# Altium schematic sheet MindPX V2.8 SCH.SchDoc
size A2; Date: 1111111111; PageSetup: Record=PageOptions|CenterHorizontal=True|CenterVertical=True|PrintScale=0.52|XCorrection=1.00|YCorrection=1.00|PrintKind=2|BorderSize=5000000|LeftOffset=0|BottomOffset=0|Orientation=2|PaperLength=1000|PaperWidth=1000|Scale=100|PaperSource=7|PrintQuality=600|MediaType=1|DitherType=10|PaperKind=A4|PrintScaleMode=1
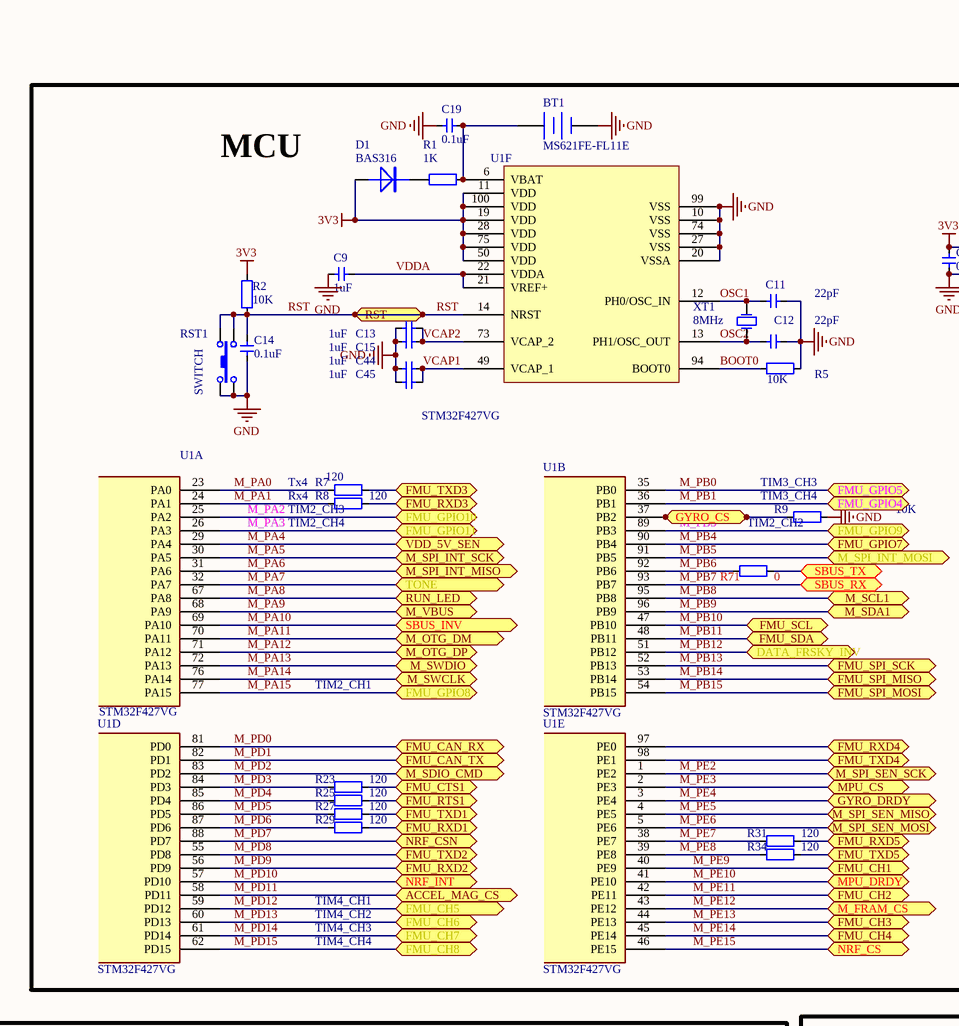
[diagram p0: MindPX V2.8 SCH.SchDoc, top left]
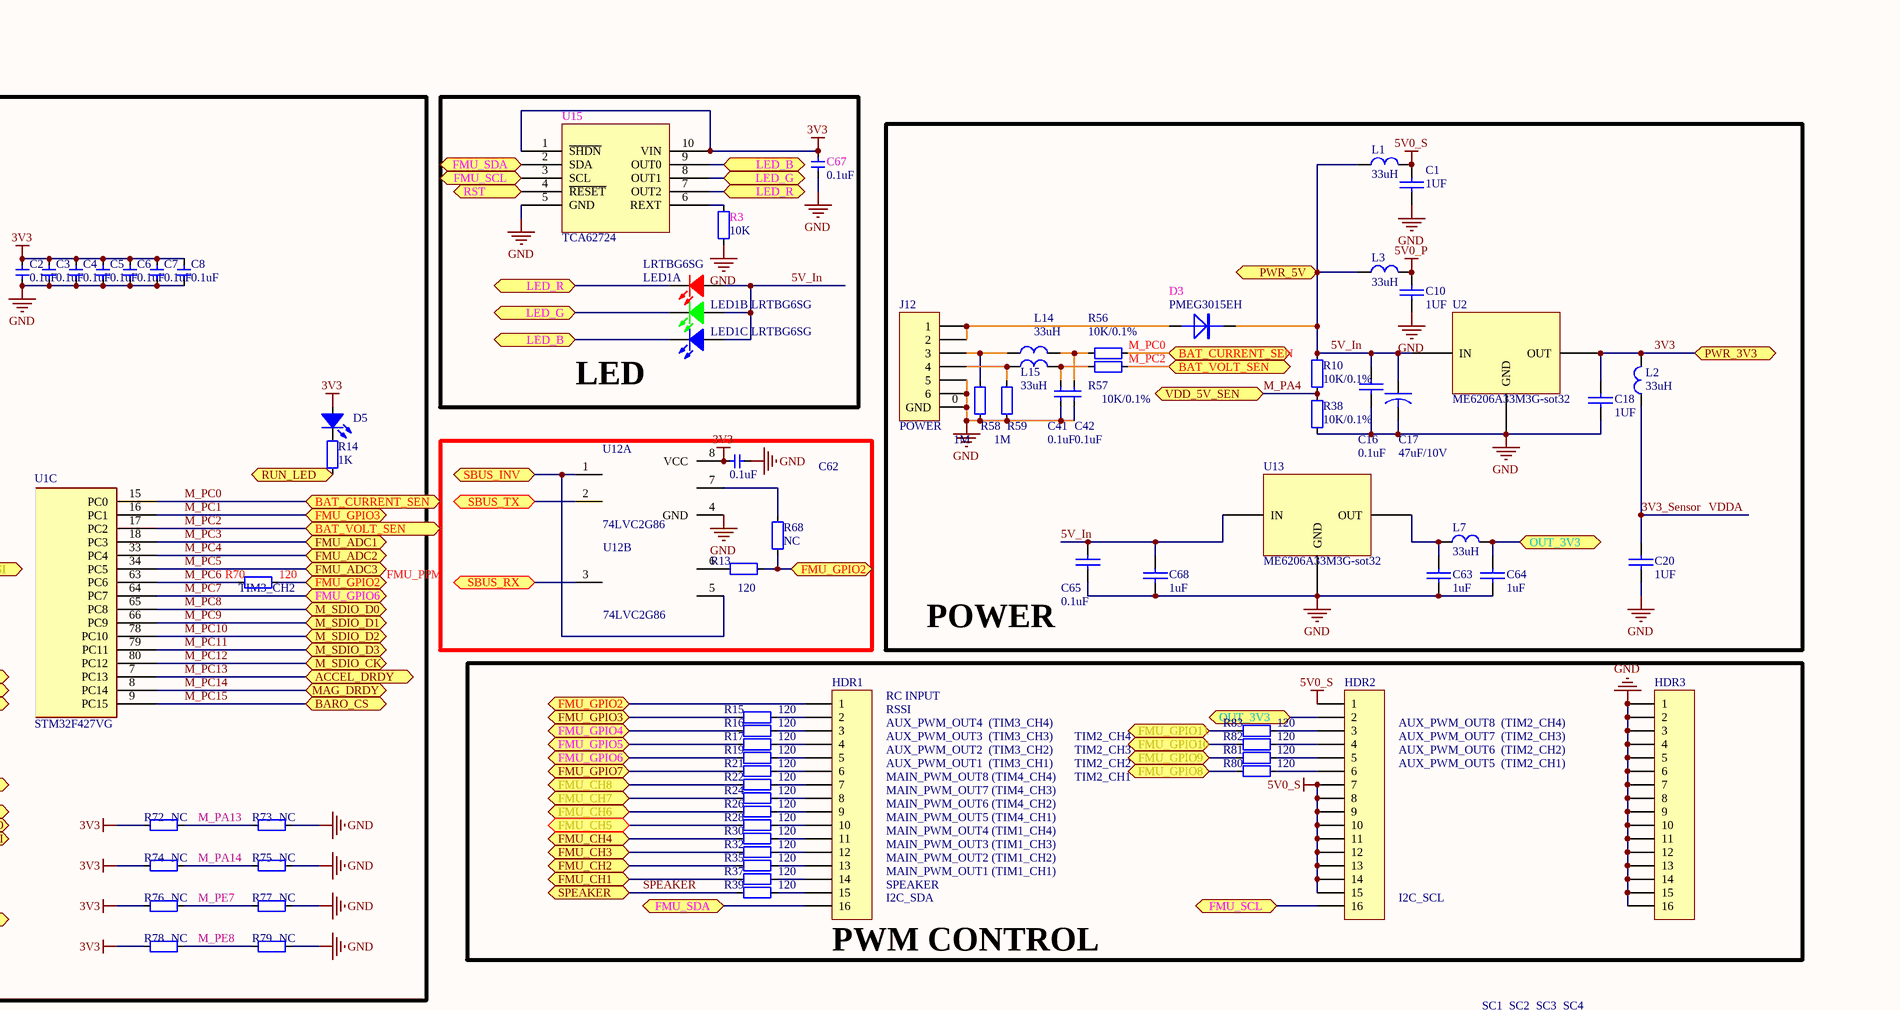
[diagram p1: MindPX V2.8 SCH.SchDoc, top right]
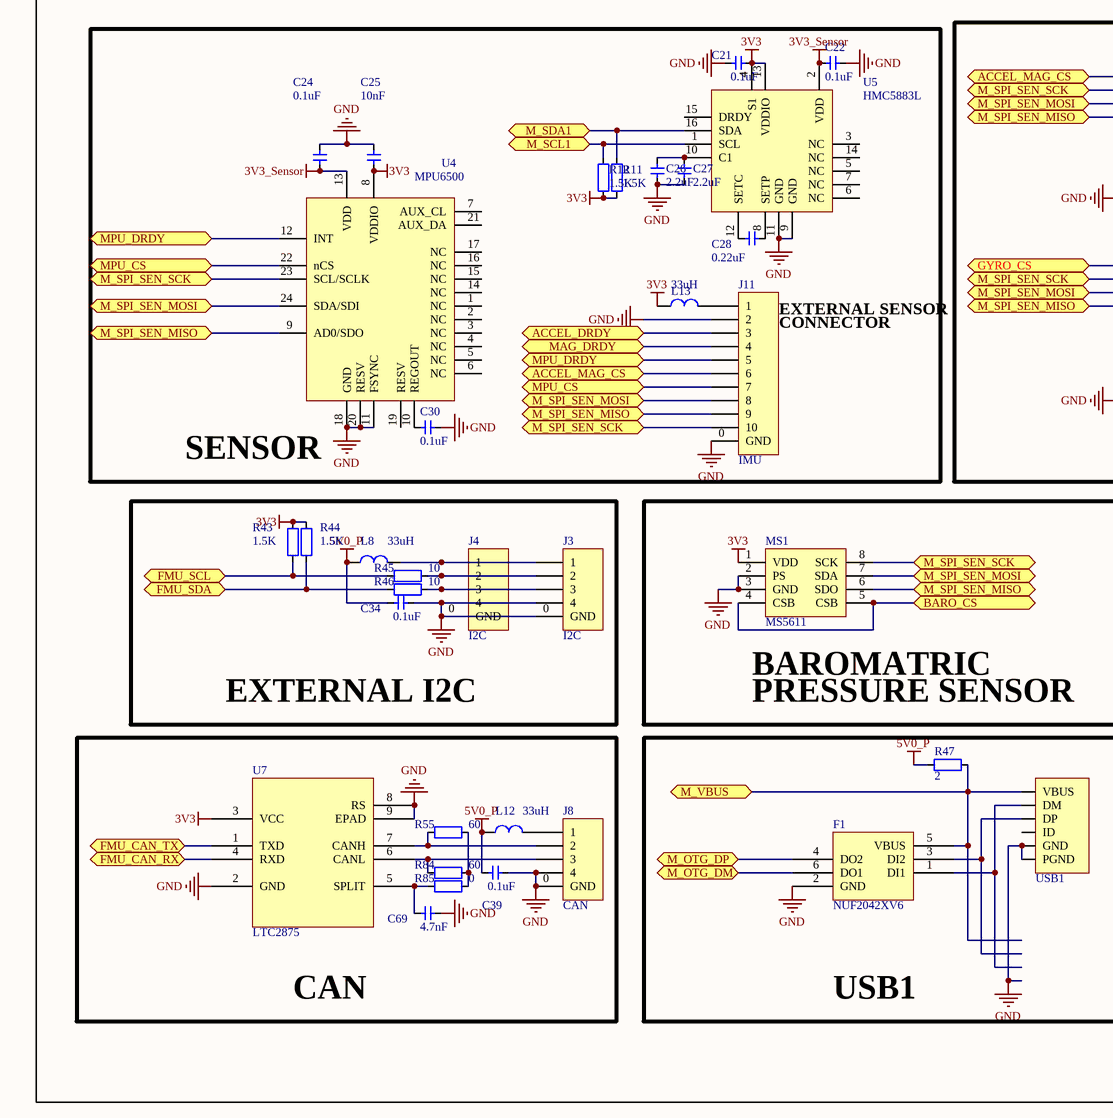
[diagram p2: MindPX V2.8 SCH.SchDoc, bottom left]
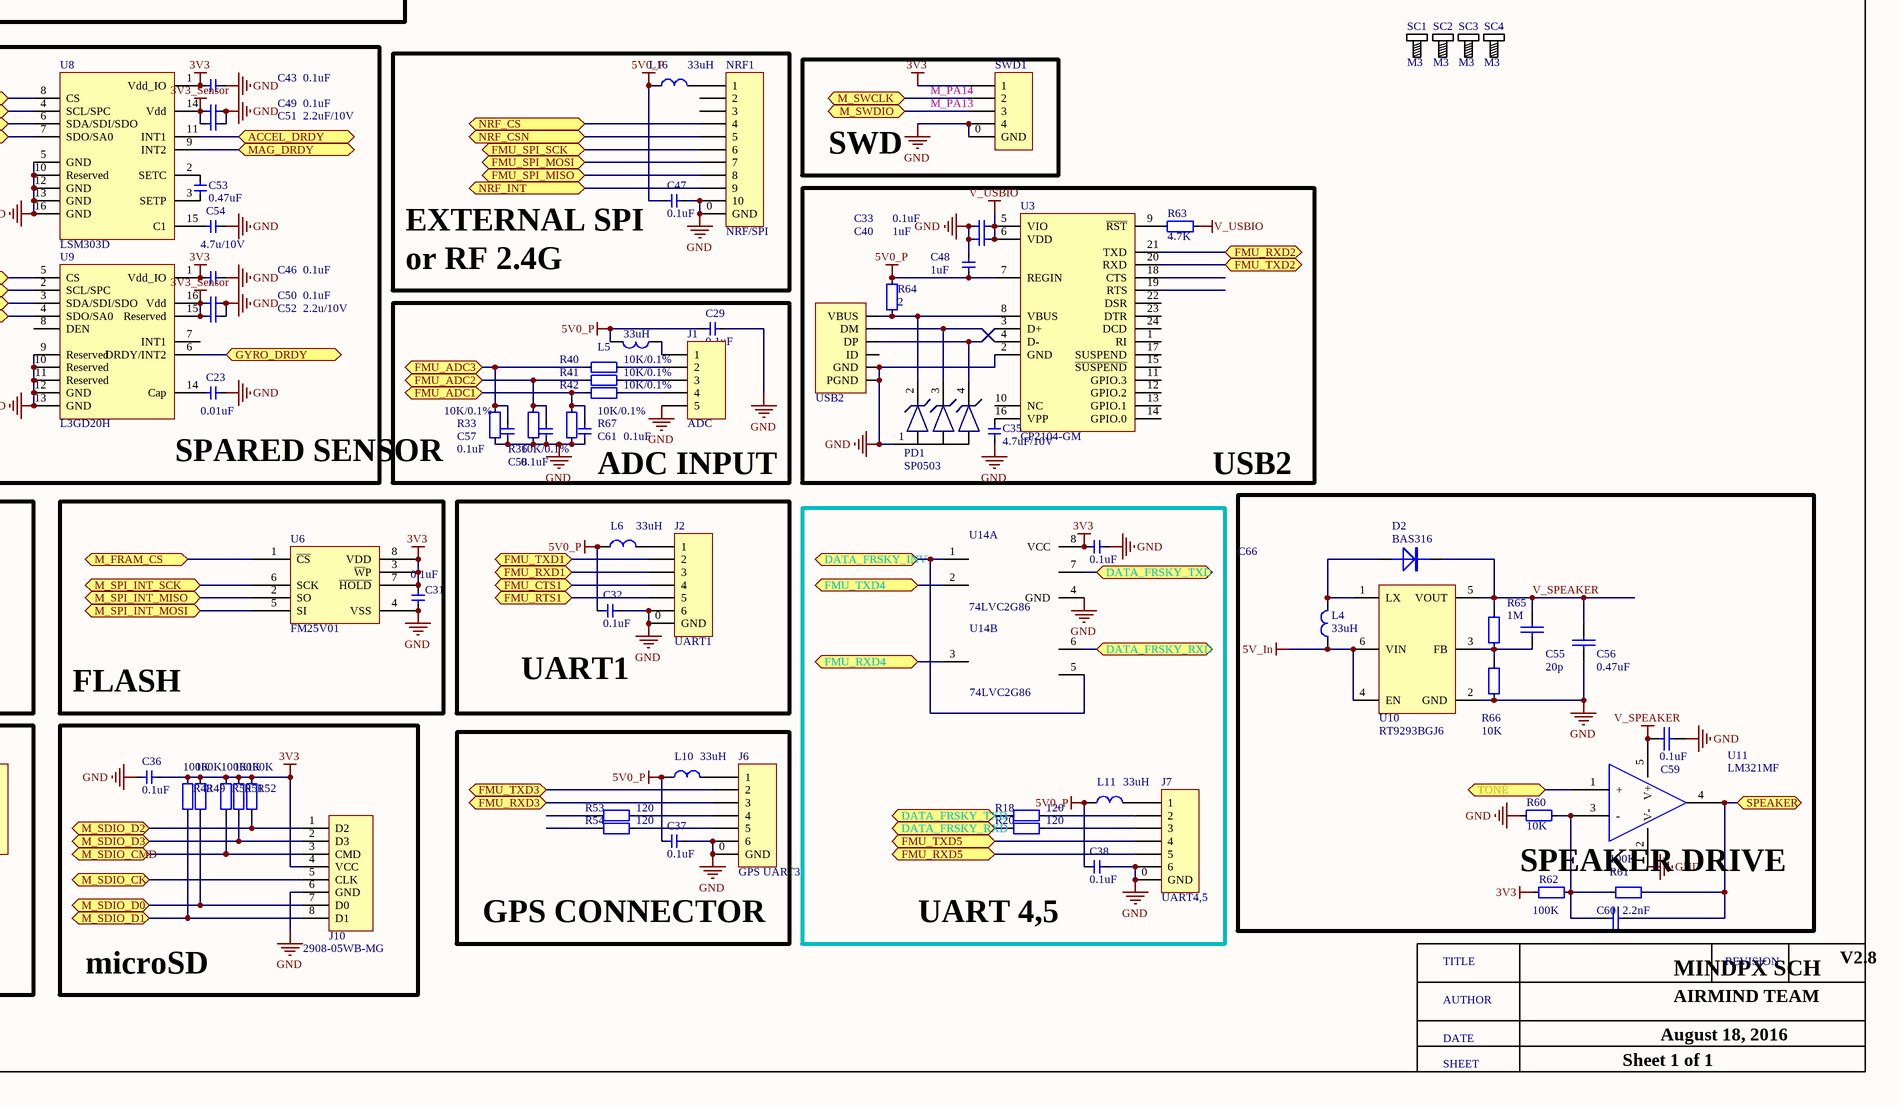
[diagram p3: MindPX V2.8 SCH.SchDoc, bottom right]

## Parts
BT1  MS621FE-FL11E  [MS621FE]
C1  1UF  [C0603]
C2  0.1uF  [C0603]
C3  0.1uF  [C0603]
C4  0.1uF  [C0603]
C5  0.1uF  [C0603]
C6  0.1uF  [C0603]
C7  0.1uF  [C0603]
C8  0.1uF  [C0603]
C9  1uF  [C0603]
C10  1UF  [C0603]
C11  22pF  [C0603]
C12  22pF  [C0603]
C13  1uF  [C0603]
C14  0.1uF  [C0603]
C15  1uF  [C0603]
C16  0.1uF  [C0603]
C17  47uF/10V  [钽电容]
C18  1UF  [C0603]
C19  0.1uF  [C0603]
C20  1UF  [C0603]
C21  0.1uF  [C0603]
C22  0.1uF  [C0603]
C23  0.01uF  [C0603]
C24  0.1uF  [C0603]
C25  10nF  [C0603]
C26  2.2uF  [C0603]
C27  2.2uF  [C0603]
C28  0.22uF  [C0603]
C29  0.1uF  [C0603]
C30  0.1uF  [C0603]
C31  0.1uF  [C0603]
C32  0.1uF  [C0603]
C33  0.1uF  [C0603]
C34  0.1uF  [C0603]
C35  4.7uF/10V  [C0603]
C36  0.1uF  [C0603]
C37  0.1uF  [C0603]
C38  0.1uF  [C0603]
C39  0.1uF  [C0603]
C40  1uF  [C0603]
C41  0.1uF  [C0603]
C42  0.1uF  [C0603]
C43  0.1uF  [C0603]
C44  1uF  [C0603]
C45  1uF  [C0603]
C46  0.1uF  [C0603]
C47  0.1uF  [C0603]
C48  1uF  [C0603]
C49  0.1uF  [C0603]
C50  0.1uF  [C0603]
C51  2.2uF/10V  [C0603]
C52  2.2u/10V  [C0603]
C53  0.47uF  [C0603]
C54  4.7u/10V  [C0603]
C55  20p  [C0603]
C56  0.47uF  [C0805]
C57  0.1uF  [C0603]
C58  0.1uF  [C0603]
C59  0.1uF  [C0603]
C60  2.2nF  [C0603]
C61  0.1uF  [C0603]
C62  0.1uF  [C0603]
C63  1uF  [C0603]
C64  1uF  [C0603]
C65  0.1uF  [C0603]
C66  0.1uF  [C0603]
C67  0.1uF  [C0603]
C68  1uF  [C0603]
C69  4.7nF  [C0603]
D1  BAS316  [SOD323_AK]
D2  BAS316  [SOD323_AK]
D3  PMEG3015EH  [SOD123/X.85]
D5  LED_0603  [0603]  (value not drawn)
F1  NUF2042XV6  [SOT-563-6]
HDR1  MHDR1X16  [HDR1X16]  (value not drawn)
HDR2  MHDR1X16  [HDR1X16]  (value not drawn)
HDR3  MHDR1X16  [HDR1X16]  (value not drawn)
J1  ADC  [HDR1X5]
J2  UART1  [DF13A-6P-1.25H]
J3  I2C  [DF13A-4P-1.25H]
J4  I2C  [DF13A-4P-1.25H]
J6  GPS UART3  [DF13A-6P-1.25H]
J7  UART4,5  [DF13A-6P-1.25H]
J8  CAN  [DF13A-4P-1.25H]
J10  2908-05WB-MG  [SD_Card_TF]
J11  IMU  [FPC10/0.5]
J12  POWER  [DF13A-6P-1.25H]
L1  33uH  [L0603]
L2  33uH  [L0603]
L3  33uH  [L0603]
L4  33uH  [L0805]
L5  33uH  [L0603]
L6  33uH  [L0603]
L7  33uH  [L0603]
L8  33uH  [L0603]
L10  33uH  [L0603]
L11  33uH  [L0603]
L12  33uH  [L0603]
L13  33uH  [L0603]
L14  33uH  [L0603]
L15  33uH  [L0603]
L16  33uH  [L0603]
LED1  LRTBG6SG  [LRTBG6SG]  (parts A,B,C of 3)
MS1  MS5611  [MS5611]
NRF1  NRF/SPI  [DF13A-10P-1.25H]
PD1  SP0503
R1  1K  [R0603]
R2  10K  [R0603]
R3  10K  [R0603]
R5  10K  [R0603]
R7  120  [R0603]
R8  120  [R0603]
R9  10K  [R0603]
R10  10K/0.1%  [R0603]
R11  1.5K  [R0603]
R12  1.5K  [R0603]
R13  120  [R0603]
R14  1K  [R0603]
R15  120  [R0603]
R16  120  [R0603]
R17  120  [R0603]
R18  120  [R0603]
R19  120  [R0603]
R20  120  [R0603]
R21  120  [R0603]
R22  120  [R0603]
R23  120  [R0603]
R24  120  [R0603]
R25  120  [R0603]
R26  120  [R0603]
R27  120  [R0603]
R28  120  [R0603]
R29  120  [R0603]
R30  120  [R0603]
R31  120  [R0603]
R32  120  [R0603]
R33  10K/0.1%  [R0603]
R34  120  [R0603]
R35  120  [R0603]
R36  10K/0.1%  [R0603]
R37  120  [R0603]
R38  10K/0.1%  [R0603]
R39  120  [R0603]
R40  10K/0.1%  [R0603]
R41  10K/0.1%  [R0603]
R42  10K/0.1%  [R0603]
R43  1.5K  [R0603]
R44  1.5K  [R0603]
R45  10  [R0603]
R46  10  [R0603]
R47  2  [R0603]
R48  100K  [R0603]
R49  100K  [R0603]
R50  100K  [R0603]
R51  100K  [R0603]
R52  100K  [R0603]
R53  120  [R0603]
R54  120  [R0603]
R55  60  [R0603]
R56  10K/0.1%  [R0603]
R57  10K/0.1%  [R0603]
R58  1M  [R0603]
R59  1M  [R0603]
R60  10K  [R0603]
R61  100K  [R0603]
R62  100K  [R0603]
R63  4.7K  [R0603]
R64  2  [R0603]
R65  1M  [R0603]
R66  10K  [R0603]
R67  10K/0.1%  [R0603]
R68  NC  [R0603]
R70  120  [R0603]
R71  0  [R0603]
R72  NC  [R0603]
R73  NC  [R0603]
R74  NC  [R0603]
R75  NC  [R0603]
R76  NC  [R0603]
R77  NC  [R0603]
R78  NC  [R0603]
R79  NC  [R0603]
R80  120  [R0603]
R81  120  [R0603]
R82  120  [R0603]
R83  120  [R0603]
R84  60  [R0603]
R85  0  [R0603]
RST1  SWITCH  [BT_TACT_3.5*3.55_90]
SC1  M3  [SCRREW_M3]
SC2  M3  [SCRREW_M3]
SC3  M3  [SCRREW_M3]
SC4  M3  [SCRREW_M3]
SWD1  DEBUG  [DF13A-4P-1.25H]  (value not drawn)
U1  STM32F427VG  (parts A,B,C,D,E,F of 6)
U2  ME6206A33M3G-sot32  [me6206a33mg-sot23]
U3  CP2104-GM  [QFN24]
U4  MPU6500  [MPU6500]
U5  HMC5883L  [LPcc16]
U6  FM25V01  [so8]
U7  LTC2875  [DFN-8_DD]
U8  LSM303D  [LSM303D]
U9  L3GD20H  [L3GD20H]
U10  RT9293BGJ6  [TSOT23-6]
U11  LM321MF  [SOT23-5]
U12  74LVC2G86  [VSSOP8]  (parts A,B of 2)
U13  ME6206A33M3G-sot32  [me6206a33mg-sot23]
U14  74LVC2G86  [VSSOP8]  (parts A,B of 2)
U15  TCA62724  [SON10]
USB1  USB_QG  [MicroUSB_T2]  (value not drawn)
USB2  USB_Micro  [MicroUSB_T2]  (value not drawn)
XT1  value 8MHz  [XTAL_5032]  (hidden comment: XTAL_5032_2P)

## Blocks framed on the sheet
MCU: BT1 C2-C9 C11-C15 C19 C44 C45 D1 D5 R1 R2 R5 R7-R9 R14 R23 R25 R27 R29 R31 R34 R70-R79 RST1 U1 XT1
LED: C67 LED1 R3 U15
POWER: C1 C10 C16-C18 C20 C41 C42 C63-C65 C68 D3 J12 L1-L3 L7 L14 L15 R10 R38 R56-R59 U2 U13
PWM CONTROL: HDR1-HDR3 R15-R17 R19 R21 R22 R24 R26 R28 R30 R32 R35 R37 R39 R80-R83
SENSOR: C21 C22 C24-C28 C30 J11 L13 R11 R12 U4 U5
SPARED SENSOR: C23 C43 C46 C49-C54 U8 U9
SWD: SWD1
USB2: C33 C35 C40 C48 PD1 R63 R64 U3 USB2
ADC INPUT: C29 C57 C58 C61 J1 L5 R33 R36 R40-R42 R67
EXTERNAL I2C: C34 J3 J4 L8 R43-R46
FLASH: C31 U6
UART1: C32 J2 L6
UART 4,5: C38 C66 J7 L11 R18 R20 U14
SPEAKER DRIVE: C55 C56 C59 C60 D2 L4 R60-R62 R65 R66 U10 U11
CAN: C39 C69 J8 L12 R55 R84 R85 U7
USB1: F1 R47 USB1
GPS CONNECTOR: C37 J6 L10 R53 R54

## Ports
ACCEL_DRDY, ACCEL_MAG_CS, BARO_CS, BAT_CURRENT_SEN, BAT_VOLT_SEN, DATA_FRSKY_INV, DATA_FRSKY_RXD, DATA_FRSKY_TXD, FMU_ADC1, FMU_ADC2, FMU_ADC3, FMU_CAN_RX, FMU_CAN_TX, FMU_CH1, FMU_CH2, FMU_CH3, FMU_CH4, FMU_CH5, FMU_CH6, FMU_CH7, FMU_CH8, FMU_CTS1, FMU_GPIO2, FMU_GPIO3, FMU_GPIO4, FMU_GPIO5, FMU_GPIO6, FMU_GPIO7, FMU_GPIO8, FMU_GPIO9, FMU_GPIO10, FMU_GPIO11, FMU_RTS1, FMU_RXD1, FMU_RXD2, FMU_RXD3, FMU_RXD4, FMU_RXD5, FMU_SCL, FMU_SDA, FMU_SPI_MISO, FMU_SPI_MOSI, FMU_SPI_SCK, FMU_TXD1, FMU_TXD2, FMU_TXD3, FMU_TXD4, FMU_TXD5, GYRO_CS, GYRO_DRDY, LED_B, LED_G, LED_R, M_FRAM_CS, M_OTG_DM, M_OTG_DP, M_SCL1, M_SDA1, M_SDIO_CK, M_SDIO_CMD, M_SDIO_D0, M_SDIO_D1, M_SDIO_D2, M_SDIO_D3, M_SPI_INT_MISO, M_SPI_INT_MOSI, M_SPI_INT_SCK, M_SPI_SEN_MISO, M_SPI_SEN_MOSI, M_SPI_SEN_SCK, M_SWCLK, M_SWDIO, M_VBUS, MAG_DRDY, MPU_CS, MPU_DRDY, NRF_CS, NRF_CSN, NRF_INT, OUT_3V3, PWR_3V3, PWR_5V, RST, RUN_LED, SBUS_INV, SBUS_RX, SBUS_TX, SPEAKER, TONE, VDD_5V_SEN

## Nets
3V3: C2.1 C3.1 C4.1 C5.1 C6.1 C7.1 C8.1 C18.1 C21.2 C25.1 C31.1 C36.1 C43.2 C46.2 C62.1 C66.1 C67.2 D1.A D5.2(A) J10.4(VCC) L2.2 L13.1 MS1.1(VDD) R2.2 R11.2 R12.1 R43.1 R44.1 R48.1 R49.1 R50.1 R51.1 R52.1 R62.2 R72.2 R74.2 R76.2 R78.2 SWD1.1 U1.11(VDD) U1.19(VDD) U1.28(VDD) U1.50(VDD) U1.75(VDD) U1.100(VDD) U2.2(OUT) U4.8(VDDIO) U5.4(S1) U5.13(VDDIO) U6.3(~{W}P) U6.7(~{HOLD}) U6.8(VDD) U7.3(VCC) U8.1(Vdd_IO) U9.1(Vdd_IO) U12.8(VCC) U14.8(VCC) U15.1(~{SHDN}) U15.10(VIN) ; port PWR_3V3
3V3_Sensor: C9.1 C20.1 C22.1 C24.2 C49.2 C50.2 C51.2 C52.2 L2.1 U1.21(VREF+) U1.22(VDDA) U4.13(VDD) U5.2(VDD) U8.14(Vdd) U9.15(Reserved) U9.16(Vdd)  [also labelled VDDA]
5V0_P: C10.1 C29.1 C32.1 C34.1 C37.1 C38.1 C39.1 C47.1 C48.2 L3.2 L5.2 L6.1 L8.1 L10.1 L11.1 L12.1 L16.1 R47.1 R64.1 U3.7(REGIN)
5V0_S: C1.1 HDR2.1 HDR2.7 HDR2.8 HDR2.9 HDR2.10 HDR2.11 HDR2.12 HDR2.13 HDR2.14 HDR2.15 L1.2
5V_In: C16.1 C17.1 C65.1 C68.1 D3.K L1.1 L3.1 L4.1 LED1.A1 LED1.A2 LED1.A3 R10.1 U2.3(IN) U10.4(EN) U10.6(VIN) U13.3(IN) ; port PWR_5V
GND: BT1.2(-) C1.2 C2.2 C3.2 C4.2 C5.2 C6.2 C7.2 C8.2 C9.2 C10.2 C11.1 C12.1 C13.1 C14.2 C15.2 C16.2 C17.2 C18.2 C19.2 C20.2 C21.1 C22.2 C23.1 C24.1 C25.2 C26.1 C27.1 C29.2 C30.1 C31.2 C32.2 C33.1 C34.2 C35.1 C36.2 C37.2 C38.2 C39.2 C40.1 C41.2 C42.2 C43.1 C44.2 C45.2 C46.1 C47.2 C48.1 C49.1 C50.1 C51.1 C52.1 C54.1 C56.2 C57.1 C58.1 C59.2 C61.1 C62.2 C63.2 C64.2 C65.2 C66.2 C67.1 C68.2 C69.2 F1.2(GND) HDR3.1 HDR3.2 HDR3.3 HDR3.4 HDR3.5 HDR3.6 HDR3.7 HDR3.8 HDR3.9 HDR3.10 HDR3.11 HDR3.12 HDR3.13 HDR3.14 HDR3.15 HDR3.16 J1.5 J2.0(GND) J2.6 J3.0(GND) J3.4 J4.0(GND) J4.4 J6.0(GND) J6.6 J7.0(GND) J7.6 J8.0(GND) J8.4 J10.6(GND) J11.0(GND) J11.2 J12.0(GND) J12.5 J12.6 MS1.2(PS) MS1.3(GND) NRF1.0(GND) NRF1.10 PD1.1 R3.2 R5.1 R9.1 R33.2 R36.2 R38.2 R58.2 R59.2 R60.1 R66.2 R67.2 R73.1 R75.1 R77.1 R79.1 RST1.1 RST1.3 SWD1.0(GND) SWD1.4 U1.10(VSS) U1.20(VSSA) U1.27(VSS) U1.74(VSS) U1.99(VSS) U2.1(GND) U3.2(GND) U4.11(FSYNC) U4.18(GND) U4.20(RESV) U5.9(GND) U5.11(GND) U6.4(VSS) U7.2(GND) U7.8(RS) U7.9(EPAD) U8.5(GND) U8.10(Reserved) U8.12(GND) U8.13(GND) U8.16(GND) U9.9(Reserved) U9.10(Reserved) U9.11(Reserved) U9.12(GND) U9.13(GND) U10.2(GND) U11.2(V-) U12.4(GND) U13.1(GND) U14.4(GND) U15.5(GND) USB1.0(PGND) USB1.5(GND) USB2.0(PGND) USB2.5(GND)
V_SPEAKER: C55.1 C56.1 C59.1 D2.K R65.1 U10.5(VOUT) U11.5(V+)
V_USBIO: C33.2 C40.2 R63.2 U3.5(VIO) U3.6(VDD)
BOOT0: R5.2 U1.94(BOOT0)
DATA_FRSKY_RXD: R20.2 U14.6(2B) ; port DATA_FRSKY_RXD
DATA_FRSKY_TXD: R18.2 U14.7(1Y) ; port DATA_FRSKY_TXD
FMU_CTS1: J2.4 R23.1 ; port FMU_CTS1
FMU_GPIO2: HDR1.1 R13.1 R68.2 R70.1 ; port FMU_GPIO2
FMU_RTS1: J2.5 R25.1 ; port FMU_RTS1
FMU_RXD1: J2.3 R29.1 ; port FMU_RXD1
FMU_RXD3: J6.3 R8.1 ; port FMU_RXD3
FMU_RXD4: U1.97(PE0) U14.3(2Y) ; port FMU_RXD4
FMU_RXD5: J7.5 R31.1 ; port FMU_RXD5
FMU_TXD1: J2.2 R27.1 ; port FMU_TXD1
FMU_TXD3: J6.2 R7.1 ; port FMU_TXD3
FMU_TXD4: U1.98(PE1) U14.2(1B) ; port FMU_TXD4
FMU_TXD5: J7.4 R34.1 ; port FMU_TXD5
GYRO_CS: R9.2 U1.37(PB2) U9.5(CS) ; port GYRO_CS
LED_B: LED1.C3 U15.9(OUT0) ; port LED_B
LED_G: LED1.C2 U15.8(OUT1) ; port LED_G
LED_R: LED1.C1 U15.7(OUT2) ; port LED_R
M_PA0: R7.2 U1.23(PA0)
M_PA1: R8.2 U1.24(PA1)
M_PA2: R82.2 U1.25(PA2) ; port FMU_GPIO10
M_PA3: R83.2 U1.26(PA3) ; port FMU_GPIO11
M_PA4: R10.2 R38.1 U1.29(PA4) ; port VDD_5V_SEN
M_PA5: U1.30(PA5) U6.6(SCK) ; port M_SPI_INT_SCK
M_PA6: U1.31(PA6) U6.2(SO) ; port M_SPI_INT_MISO
M_PA7: U1.32(PA7) U11.1(+) ; port TONE
M_PA8: R14.1 U1.67(PA8) ; port RUN_LED
M_PA9: F1.5(VBUS) R47.2 U1.68(PA9) USB1.1(VBUS) ; port M_VBUS
M_PA10: U1.69(PA10) U12.1(1A) U12.5(2A) ; port SBUS_INV
M_PA11: F1.6(DO1) U1.70(PA11) ; port M_OTG_DM
M_PA12: F1.4(DO2) U1.71(PA12) ; port M_OTG_DP
M_PA13: R72.1 R73.2 SWD1.3 U1.72(PA13) ; port M_SWDIO
M_PA14: R74.1 R75.2 SWD1.2 U1.76(PA14) ; port M_SWCLK
M_PA15: R80.2 U1.77(PA15) ; port FMU_GPIO8
M_PB0: R17.2 U1.35(PB0) ; port FMU_GPIO5
M_PB1: R16.2 U1.36(PB1) ; port FMU_GPIO4
M_PB3: R81.2 U1.89(PB3) ; port FMU_GPIO9
M_PB4: R21.2 U1.90(PB4) ; port FMU_GPIO7
M_PB5: U1.91(PB5) U6.5(SI) ; port M_SPI_INT_MOSI
M_PB6: R71.2 U1.92(PB6)
M_PB7: U1.93(PB7) U12.3(2Y) ; port SBUS_RX
M_PB8: R12.2 U1.95(PB8) U5.1(SCL) ; port M_SCL1
M_PB9: R11.1 U1.96(PB9) U5.16(SDA) ; port M_SDA1
M_PB10: HDR2.16 R43.2 R45.2 U1.47(PB10) U15.3(SCL) ; port FMU_SCL
M_PB11: HDR1.16 R44.2 R46.2 U1.48(PB11) U15.2(SDA) ; port FMU_SDA
M_PB12: U1.51(PB12) U14.1(1A) U14.5(2A) ; port DATA_FRSKY_INV
M_PB13: NRF1.6 U1.52(PB13) ; port FMU_SPI_SCK
M_PB14: NRF1.8 U1.53(PB14) ; port FMU_SPI_MISO
M_PB15: NRF1.7 U1.54(PB15) ; port FMU_SPI_MOSI
M_PC0: R56.1 U1.15(PC0) ; port BAT_CURRENT_SEN
M_PC1: R15.2 U1.16(PC1) ; port FMU_GPIO3
M_PC2: R57.1 U1.17(PC2) ; port BAT_VOLT_SEN
M_PC3: C61.2 R42.2 R67.1 U1.18(PC3) ; port FMU_ADC1
M_PC4: C58.2 R36.1 R41.2 U1.33(PC4) ; port FMU_ADC2
M_PC5: C57.2 R33.1 R40.2 U1.34(PC5) ; port FMU_ADC3
M_PC6: R70.2 U1.63(PC6)
M_PC7: R19.2 U1.64(PC7) ; port FMU_GPIO6
M_PC8: J10.7(D0) R49.2 U1.65(PC8) ; port M_SDIO_D0
M_PC9: J10.8(D1) R48.2 U1.66(PC9) ; port M_SDIO_D1
M_PC10: J10.1(D2) R52.2 U1.78(PC10) ; port M_SDIO_D2
M_PC11: J10.2(D3) R51.2 U1.79(PC11) ; port M_SDIO_D3
M_PC12: J10.5(CLK) U1.80(PC12) ; port M_SDIO_CK
M_PC13: J11.3 U1.7(PC13) U8.11(INT1) ; port ACCEL_DRDY
M_PC14: J11.4 U1.8(PC14) U8.9(INT2) ; port MAG_DRDY
M_PC15: MS1.4(CSB) MS1.5(CSB) U1.9(PC15) ; port BARO_CS
M_PD0: U1.81(PD0) U7.4(RXD) ; port FMU_CAN_RX
M_PD1: U1.82(PD1) U7.1(TXD) ; port FMU_CAN_TX
M_PD2: J10.3(CMD) R50.2 U1.83(PD2) ; port M_SDIO_CMD
M_PD3: R23.2 U1.84(PD3)
M_PD4: R25.2 U1.85(PD4)
M_PD5: R27.2 U1.86(PD5)
M_PD6: R29.2 U1.87(PD6)
M_PD7: NRF1.5 U1.88(PD7) ; port NRF_CSN
M_PD8: U1.55(PD8) U3.20(RXD) ; port FMU_TXD2
M_PD9: U1.56(PD9) U3.21(TXD) ; port FMU_RXD2
M_PD10: NRF1.9 U1.57(PD10) ; port NRF_INT
M_PD11: J11.6 U1.58(PD11) U8.8(CS) ; port ACCEL_MAG_CS
M_PD12: R28.2 U1.59(PD12) ; port FMU_CH5
M_PD13: R26.2 U1.60(PD13) ; port FMU_CH6
M_PD14: R24.2 U1.61(PD14) ; port FMU_CH7
M_PD15: R22.2 U1.62(PD15) ; port FMU_CH8
M_PE2: J11.10 MS1.8(SCK) U1.1(PE2) U4.23(SCL/SCLK) U8.4(SCL/SPC) U9.2(SCL/SPC) ; port M_SPI_SEN_SCK
M_PE3: J11.7 U1.2(PE3) U4.22(nCS) ; port MPU_CS
M_PE4: U1.3(PE4) U9.6(DRDY/INT2) ; port GYRO_DRDY
M_PE5: J11.9 MS1.6(SDO) U1.4(PE5) U4.9(AD0/SDO) U8.7(SDO/SA0) U9.4(SDO/SA0) ; port M_SPI_SEN_MISO
M_PE6: J11.8 MS1.7(SDA) U1.5(PE6) U4.24(SDA/SDI) U8.6(SDA/SDI/SDO) U9.3(SDA/SDI/SDO) ; port M_SPI_SEN_MOSI
M_PE7: R31.2 R76.1 R77.2 U1.38(PE7)
M_PE8: R34.2 R78.1 R79.2 U1.39(PE8)
M_PE9: R37.2 U1.40(PE9) ; port FMU_CH1
M_PE10: J11.5 U1.41(PE10) U4.12(INT) ; port MPU_DRDY
M_PE11: R35.2 U1.42(PE11) ; port FMU_CH2
M_PE12: U1.43(PE12) U6.1(~{CS}) ; port M_FRAM_CS
M_PE13: R32.2 U1.44(PE13) ; port FMU_CH3
M_PE14: R30.2 U1.45(PE14) ; port FMU_CH4
M_PE15: NRF1.4 U1.46(PE15) ; port NRF_CS
OSC1: C11.2 U1.12(PH0/OSC_IN) XT1.2(OSC2)
OSC2: C12.2 U1.13(PH1/OSC_OUT) XT1.1(OSC1)
OUT_3V3: C64.1 HDR2.2 L7.2 ; port OUT_3V3
RST: C14.1 R2.1 RST1.2 RST1.4 U1.14(NRST) U15.4(~{RESET}) ; port RST
SBUS_TX: R71.1 U12.2(1B) ; port SBUS_TX
SPEAKER: C60.2 R39.2 R61.2 U11.4 ; port SPEAKER
VCAP1: C44.1 C45.1 U1.49(VCAP_1)
VCAP2: C13.2 C15.1 U1.73(VCAP_2)
NetBT1_1: BT1.1(+) C19.1 R1.1 U1.6(VBAT)
NetC23_2: C23.2 U9.14(Cap)
NetC26_2: C26.2 C27.2 U5.10(C1)
NetC28_1: C28.1 U5.12(SETC)
NetC28_2: C28.2 U5.8(SETP)
NetC30_2: C30.2 U4.10(REGOUT)
NetC35_2: C35.2 U3.16(VPP)
NetC41_1: C41.1 L15.1 R57.2
NetC42_1: C42.1 L14.1 R56.2
NetC53_1: C53.1 U8.2(SETC)
NetC53_2: C53.2 U8.3(SETP)
NetC54_2: C54.2 U8.15(C1)
NetC55_2: C55.2 R65.2 R66.1 U10.3(FB)
NetC60_1: C60.1 R60.2 R61.1 R62.1 U11.3(-)
NetC63_1: C63.1 L7.1 U13.2(OUT)
NetC69_1: C69.1 R85.2 U7.5(SPLIT)
NetD1_K: D1.K R1.2
NetD2_A: D2.A L4.2 U10.1(LX)
NetD3_A: D3.A J12.1 J12.2
NetD5_1: D5.1(K) R14.2
NetF1_1: F1.1(DI1) USB1.2(DM)
NetF1_3: F1.3(DI2) USB1.3(DP)
NetHDR1_2: HDR1.2 R15.1
NetHDR1_3: HDR1.3 R16.1
NetHDR1_4: HDR1.4 R17.1
NetHDR1_5: HDR1.5 R19.1
NetHDR1_6: HDR1.6 R21.1
NetHDR1_7: HDR1.7 R22.1
NetHDR1_8: HDR1.8 R24.1
NetHDR1_9: HDR1.9 R26.1
NetHDR1_10: HDR1.10 R28.1
NetHDR1_11: HDR1.11 R30.1
NetHDR1_12: HDR1.12 R32.1
NetHDR1_13: HDR1.13 R35.1
NetHDR1_14: HDR1.14 R37.1
NetHDR1_15: HDR1.15 R39.1
NetHDR2_3: HDR2.3 R83.1
NetHDR2_4: HDR2.4 R82.1
NetHDR2_5: HDR2.5 R81.1
NetHDR2_6: HDR2.6 R80.1
NetJ1_1: J1.1 L5.1
NetJ1_2: J1.2 R40.1
NetJ1_3: J1.3 R41.1
NetJ1_4: J1.4 R42.1
NetJ2_1: J2.1 L6.2
NetJ3_1: J3.1 J4.1 L8.2
NetJ3_2: J3.2 J4.2 R45.1
NetJ3_3: J3.3 J4.3 R46.1
NetJ6_1: J6.1 L10.2
NetJ6_4: J6.4 R53.1
NetJ6_5: J6.5 R54.1
NetJ7_1: J7.1 L11.2
NetJ7_2: J7.2 R18.1
NetJ7_3: J7.3 R20.1
NetJ8_1: J8.1 L12.2
NetJ8_2: J8.2 R55.2 U7.7(CANH)
NetJ8_3: J8.3 R84.2 U7.6(CANL)
NetJ11_1: J11.1 L13.2
NetJ12_3: J12.3 L14.2 R58.1
NetJ12_4: J12.4 L15.2 R59.1
NetL16_2: L16.2 NRF1.1
NetPD1_2: PD1.2 R64.2 U3.8(VBUS) USB2.1(VBUS)
NetPD1_3: PD1.3 U3.4(D-) USB2.2(DM)
NetPD1_4: PD1.4 U3.3(D+) USB2.3(DP)
NetR3_1: R3.1 U15.6(REXT)
NetR13_2: R13.2 U12.6(2B)
NetR55_1: R55.1 R84.1 R85.1
NetR63_1: R63.1 U3.9(~{RST})
NetR68_1: R68.1 U12.7(1Y)

Not connected (* = marked no-connect by the designer): NRF1 2 3; R53 2; R54 2; SC1 0; SC2 0(GND); SC3 0(GND); SC4 0(GND); U3 1(RI) 10(NC) 11(GPIO.3) 12(GPIO.2) 13(GPIO.1) 14(GPIO.0) 15(~{SUSPEND}) 17(SUSPEND) 18(CTS) 19(RTS) 22(DSR) 23(DTR) 24(DCD); U4 1(NC) 2(NC) 3(NC) 4(NC) 5(NC) 6(NC) 7(AUX_CL) 14(NC) 15(NC) 16(NC) 17(NC) 19(RESV) 21(AUX_DA); U5 3(NC) 5(NC) 6(NC) 7(NC) 14(NC) 15(DRDY); U9 7(INT1) 8(DEN); USB1 4(ID); USB2 4(ID)

## Notes on the sheet
- Tx4
- Rx4
- (near R9) TIM3_CH3
- (near R9) TIM3_CH4
- (near R8) TIM2_CH3
- (near R8) TIM2_CH4
- (near R9) TIM2_CH2
- FMU_PPM
- (near R70) TIM3_CH2
- TIM2_CH1
- RSSI
- RC INPUT
- MAIN_PWM_OUT8 (TIM4_CH4)
- AUX_PWM_OUT1  (TIM3_CH1)
- AUX_PWM_OUT2  (TIM3_CH2)
- AUX_PWM_OUT3  (TIM3_CH3)
- AUX_PWM_OUT4  (TIM3_CH4)
- TIM2_CH2
- TIM2_CH3
- TIM2_CH4
- AUX_PWM_OUT5  (TIM2_CH1)
- AUX_PWM_OUT6  (TIM2_CH2)
- AUX_PWM_OUT7  (TIM2_CH3)
- AUX_PWM_OUT8  (TIM2_CH4)
- MAIN_PWM_OUT3 (TIM1_CH3)
- MAIN_PWM_OUT4 (TIM1_CH4)
- MAIN_PWM_OUT7 (TIM4_CH3)
- MAIN_PWM_OUT6 (TIM4_CH2)
- MAIN_PWM_OUT5 (TIM4_CH1)
- TIM4_CH1
- MAIN_PWM_OUT1 (TIM1_CH1)
- MAIN_PWM_OUT2 (TIM1_CH2)
- SPEAKER
- I2C_SDA
- I2C_SCL
- TIM4_CH2
- TIM4_CH3
- TIM4_CH4
- EXTERNAL SPI
- (near J11) EXTERNAL SENSOR
- or RF 2.4G
- (near J11) CONNECTOR
- (near MS1) BAROMATRIC
- PRESSURE SENSOR
- TITLE
- REVISION
- V2.8
- AUTHOR
- (near C60) MINDPX SCH
- AIRMIND TEAM
- DATE
- SHEET
- Sheet 1 of 1
- August 18, 2016
- Labels drawn without touching a wire or pin: microSD
- (in symbol MPU-6500) Text

## Library data of the parts
BT1 = Battery: Multicell Battery; Published: 24-Mar-1999; LatestRevisionDate: 17-Jul-2002; LatestRevisionNote: Re-released for DXP Platform.; PackageReference: BAT-2; Publisher: Altium Limited
C1 C10 C16 C18 C20 C55 C56 C59 C60 C63-C65 C68 = CAP: Capacitor
C2-C9 C11-C15 C19 C21-C54 C57 C58 C61 C62 C66 C67 C69 = Cap_0603: Capacitor
  C2-C8 C14 C29 C32-C34 C36-C39 C41-C43 C46 C47 C49 C50 C57 C58 C61 C62 C66 C67: Value: 0.1uF
  C11 C12: Value: 22pF
  C23: Value: 0.01uF
  C35: Value: 4.7uF/10V
  C40 C48: Value: 1uF
  C51: Value: 2.2uF/10V
  C52: Value: 2.2u/10V
  C53: Value: 0.47uF
  C54: Value: 4.7u/10V
  C69: Value: 4.7nF
C17 = CAPACITOR
D1-D3 = DIODE
D5 = LED_0603: LED
HDR1-HDR3 = MHDR1X16: Header, 16-Pin; LatestRevisionDate: 17-Jul-2002; LatestRevisionNote: Re-released for DXP Platform.; Publisher: Altium Limited
J1 = Header 5: Header, 5-Pin; LatestRevisionDate: 17-Jul-2002; LatestRevisionNote: Re-released for DXP Platform.; Publisher: Altium Limited
J2 J6 J7 J12 = DF13_6: Header, 7-Pin; LatestRevisionDate: 17-Jul-2002; LatestRevisionNote: Re-released for DXP Platform.; Publisher: Altium Limited
J3 J4 J8 SWD1 = DF13_4: Header,4-Pin; LatestRevisionDate: 17-Jul-2002; LatestRevisionNote: Re-released for DXP Platform.; Publisher: Altium Limited
J10 = microSD_interface: SD
J11 NRF1 = DF13_10: Header, 8-Pin; LatestRevisionDate: 17-Jul-2002; LatestRevisionNote: Re-released for DXP Platform.; Publisher: Altium Limited
L1-L8 L10-L16 = Inductor_smt: Inductor; Code_IEC: 1005; Published: 8-Jun-2000; LatestRevisionDate: 29-May-2009; LatestRevisionNote: IPC-7351 Footprint Added.; PackageReference: 0402-A; Publisher: Altium Limited; PackageDescription: Chip Inductor; Code_JEITA: 0402
MS1 = MS5611: Sensor
R1-R3 R5 R7-R68 R70-R85 = Res_0603: Resistor
  R2 R3 R5: Value: 10K
  R8 R18 R20 R23 R25 R27 R29 R31 R34 R53 R54 R70: Value: 120
  R14: Value: 1K
  R45 R46: Value: 10
  R55 R84: Value: 60
  R68 R72-R79: Value: NC
  R85: Value: 0
RST1 = BT_TACT_3.5*5_90
SC1-SC4 = Screw_M3: Screw
U1 = STM32F427VX
U2 U13 = SOP-3
U3 = CP2104
U4 = MPU-6500
U10 = RT9293: 注意要50V的，不要搞成20V的
USB1 USB2 = USB_Micro: USB
XT1 = XTAL_5032_2P: Crystal Oscillator